# EAGLE design B134B (EAGLE 6.6.0)
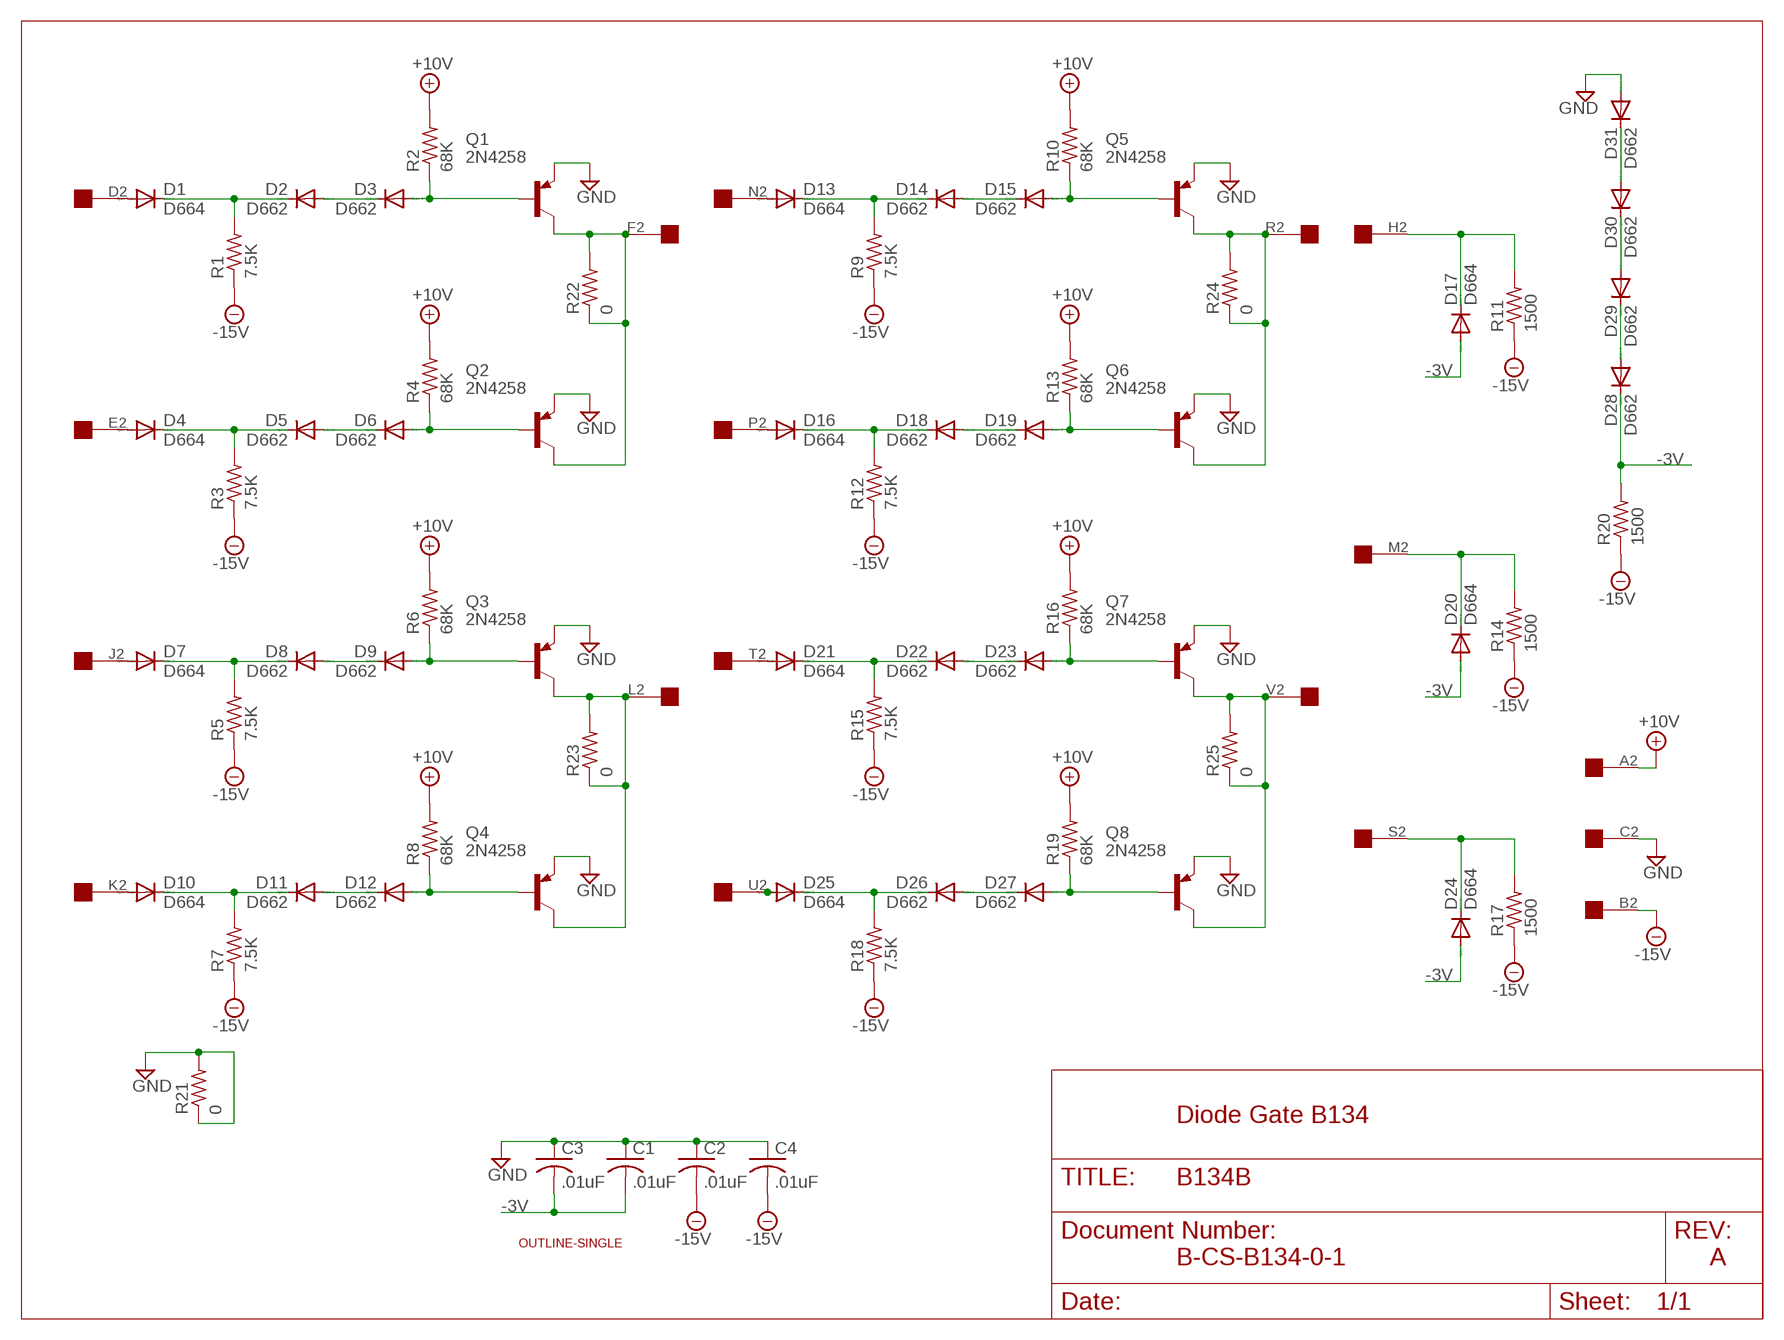
[diagram p0: schematic, sheet 1]

## Parts
C1  .01uF  C-US  [C063-025X075]
C2  .01uF  C-US  [C063-025X075]
C3  .01uF  C-US  [C063-025X075]
C4  .01uF  C-US  [C063-025X075]
D1  D664  DIODE-DO35-10  [DO35-10]
D2  D662  DIODE-DO35-10  [DO35-10]
D3  D662  DIODE-DO35-10  [DO35-10]
D4  D664  DIODE-DO35-10  [DO35-10]
D5  D662  DIODE-DO35-10  [DO35-10]
D6  D662  DIODE-DO35-10  [DO35-10]
D7  D664  DIODE-DO35-10  [DO35-10]
D8  D662  DIODE-DO35-10  [DO35-10]
D9  D662  DIODE-DO35-10  [DO35-10]
D10  D664  DIODE-DO35-10  [DO35-10]
D11  D662  DIODE-DO35-10  [DO35-10]
D12  D662  DIODE-DO35-10  [DO35-10]
D13  D664  DIODE-DO35-10  [DO35-10]
D14  D662  DIODE-DO35-10  [DO35-10]
D15  D662  DIODE-DO35-10  [DO35-10]
D16  D664  DIODE-DO35-10  [DO35-10]
D17  D664  DIODE-DO35-10  [DO35-10]
D18  D662  DIODE-DO35-10  [DO35-10]
D19  D662  DIODE-DO35-10  [DO35-10]
D20  D664  DIODE-DO35-10  [DO35-10]
D21  D664  DIODE-DO35-10  [DO35-10]
D22  D662  DIODE-DO35-10  [DO35-10]
D23  D662  DIODE-DO35-10  [DO35-10]
D24  D664  DIODE-DO35-10  [DO35-10]
D25  D664  DIODE-DO35-10  [DO35-10]
D26  D662  DIODE-DO35-10  [DO35-10]
D27  D662  DIODE-DO35-10  [DO35-10]
D28  D662  DIODE-DO35-10  [DO35-10]
D29  D662  DIODE-DO35-10  [DO35-10]
D30  D662  DIODE-DO35-10  [DO35-10]
D31  D662  DIODE-DO35-10  [DO35-10]
Q1  2N4258  -PNP-TO5  [TO5]
Q2  2N4258  -PNP-TO5  [TO5]
Q3  2N4258  -PNP-TO5  [TO5]
Q4  2N4258  -PNP-TO5  [TO5]
Q5  2N4258  -PNP-TO5  [TO5]
Q6  2N4258  -PNP-TO5  [TO5]
Q7  2N4258  -PNP-TO5  [TO5]
Q8  2N4258  -PNP-TO5  [TO5]
R1  7.5K  R-US_0207/10  [0207/10]
R2  68K  R-US_0207/10  [0207/10]
R3  7.5K  R-US_0207/10  [0207/10]
R4  68K  R-US_0207/10  [0207/10]
R5  7.5K  R-US_0207/10  [0207/10]
R6  68K  R-US_0207/10  [0207/10]
R7  7.5K  R-US_0207/10  [0207/10]
R8  68K  R-US_0207/10  [0207/10]
R9  7.5K  R-US_0207/10  [0207/10]
R10  68K  R-US_0207/10  [0207/10]
R11  1500  R-US_0207/10  [0207/10]
R12  7.5K  R-US_0207/10  [0207/10]
R13  68K  R-US_0207/10  [0207/10]
R14  1500  R-US_0207/10  [0207/10]
R15  7.5K  R-US_0207/10  [0207/10]
R16  68K  R-US_0207/10  [0207/10]
R17  1500  R-US_0207/10  [0207/10]
R18  7.5K  R-US_0207/10  [0207/10]
R19  68K  R-US_0207/10  [0207/10]
R20  1500  R-US_0207/10  [0207/10]
R21  0  R-US_0207/10  [0207/10]
R22  0  R-US_0207/10  [0207/10]
R23  0  R-US_0207/10  [0207/10]
R24  0  R-US_0207/10  [0207/10]
R25  0  R-US_0207/10  [0207/10]
U$1  OUTLINE-SINGLE  [SINGLE]
U$2  EDGE-1  [EDGE-CON1]

## Nets
+10V: R2.2 R4.2 R6.2 R8.2 R10.2 R13.2 R16.2 R19.2 U$2.A2
-3V [Supply]: C1.2 C3.2 D17.A D20.A D24.A D28.C R20.2
-15V: C2.2 C4.2 R1.1 R3.1 R5.1 R7.1 R9.1 R11.1 R12.1 R14.1 R15.1 R17.1 R18.1 R20.1 U$2.B2
GND [Supply]: C1.1 C2.1 C3.1 C4.1 D31.A Q1.1(E) Q2.1(E) Q3.1(E) Q4.1(E) Q5.1(E) Q6.1(E) Q7.1(E) Q8.1(E) R21.1 R21.2 U$2.C2
N$1: D4.C D5.C R3.2
N$2: D10.C D11.C R7.2
N$3: D3.A Q1.2(B) R2.1
N$4: D13.C D14.C R9.2
N$5: D1.C D2.C R1.2
N$6: D4.A U$2.E2
N$7: D13.A U$2.N2
N$8: D11.A D12.C
N$9: D5.A D6.C
N$10: D1.A U$2.D2
N$11: D14.A D15.C
N$12: D6.A Q2.2(B) R4.1
N$13: Q1.3(C) Q2.3(C) R22.1 R22.2 U$2.F2
N$14: D7.C D8.C R5.2
N$15: D2.A D3.C
N$16: D7.A U$2.J2
N$17: D17.C R11.2 U$2.H2
N$18: D15.A Q5.2(B) R10.1
N$19: D10.A U$2.K2
N$20: D20.C R14.2 U$2.M2
N$21: D8.A D9.C
N$22: D9.A Q3.2(B) R6.1
N$23: D16.C D18.C R12.2
N$24: D12.A Q4.2(B) R8.1
N$25: D24.C R17.2 U$2.S2
N$26: D30.A D31.C
N$27: D29.A D30.C
N$28: D19.A Q6.2(B) R13.1
N$29: D28.A D29.C
N$30: D18.A D19.C
N$31: D23.A Q7.2(B) R16.1
N$33: D21.C D22.C R15.2
N$34: D22.A D23.C
N$35: D27.A Q8.2(B) R19.1
N$36: D16.A U$2.P2
N$37: D21.A U$2.T2
N$38: D25.C D26.C R18.2
N$39: D26.A D27.C
N$41: Q7.3(C) Q8.3(C) R25.1 R25.2 U$2.V2
N$42: D25.A U$2.U2
N$44: Q3.3(C) Q4.3(C) R23.1 R23.2 U$2.L2
N$45: Q5.3(C) Q6.3(C) R24.1 R24.2 U$2.R2

## Notes on the sheet
- Diode Gate B134
- B-CS-B134-0-1 | A

## Library data of the parts
C1-C4 = dec-con:C-US: Capacitors with funky DEC lead spacing.
D1-D31 = diode:DIODE-: DIODE
Q1-Q8 = transistor:*-PNP-: PNP Transistror
R1-R25 = rcl:R-US_: RESISTOR, American symbol
U$1 = dec-con:OUTLINE-*: Board outlines for DEC boards.
U$2 = dec-con:EDGE-1: Single-Sided DEC Edge Connector -- (side 2)

## Net classes
0 default: width 0.813 mm
1 Supply: width 0.813 mm

## Board
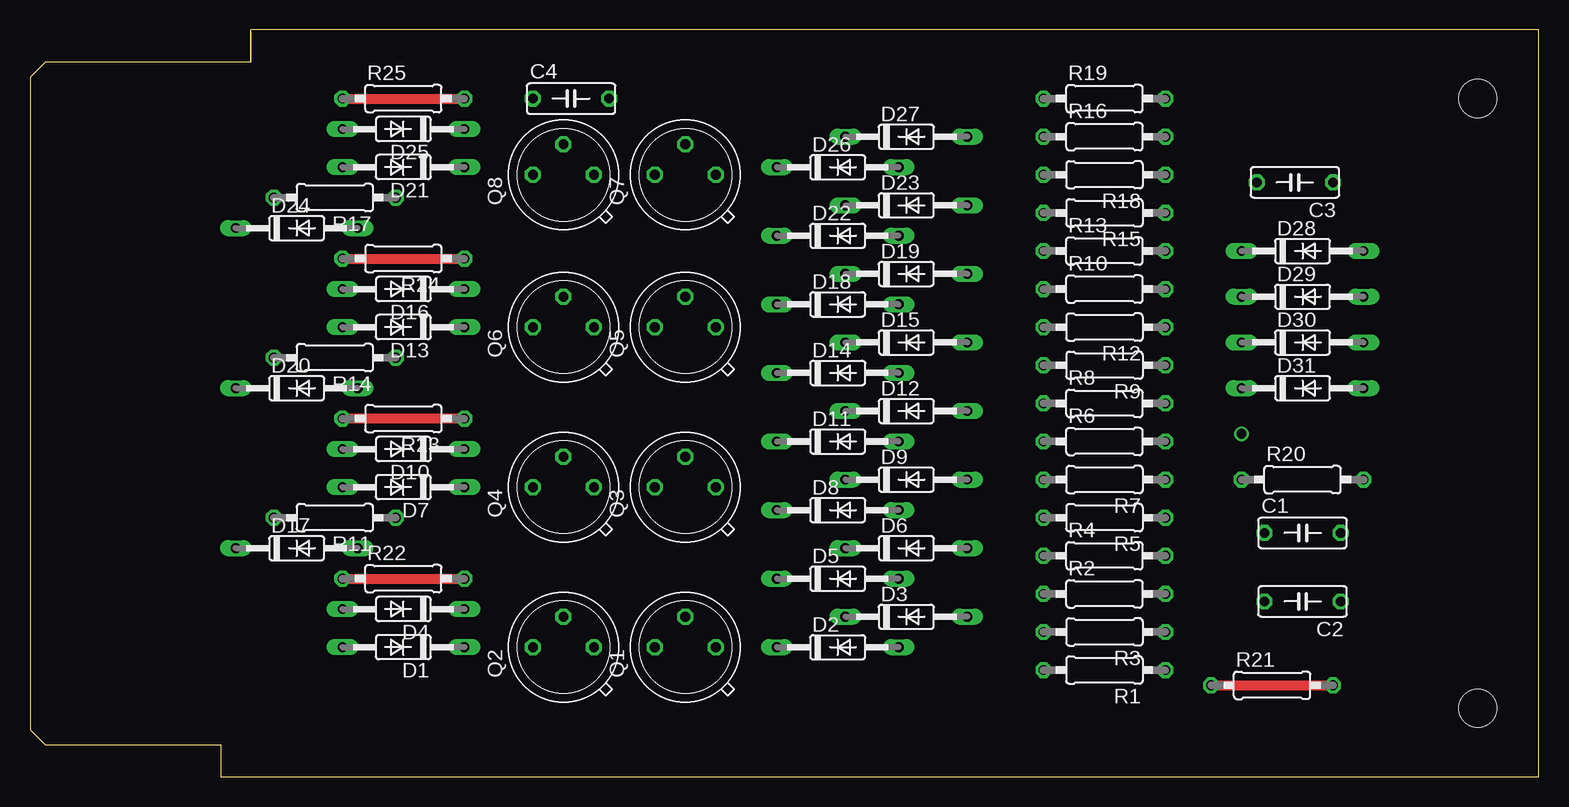
[diagram p1: board, top side]
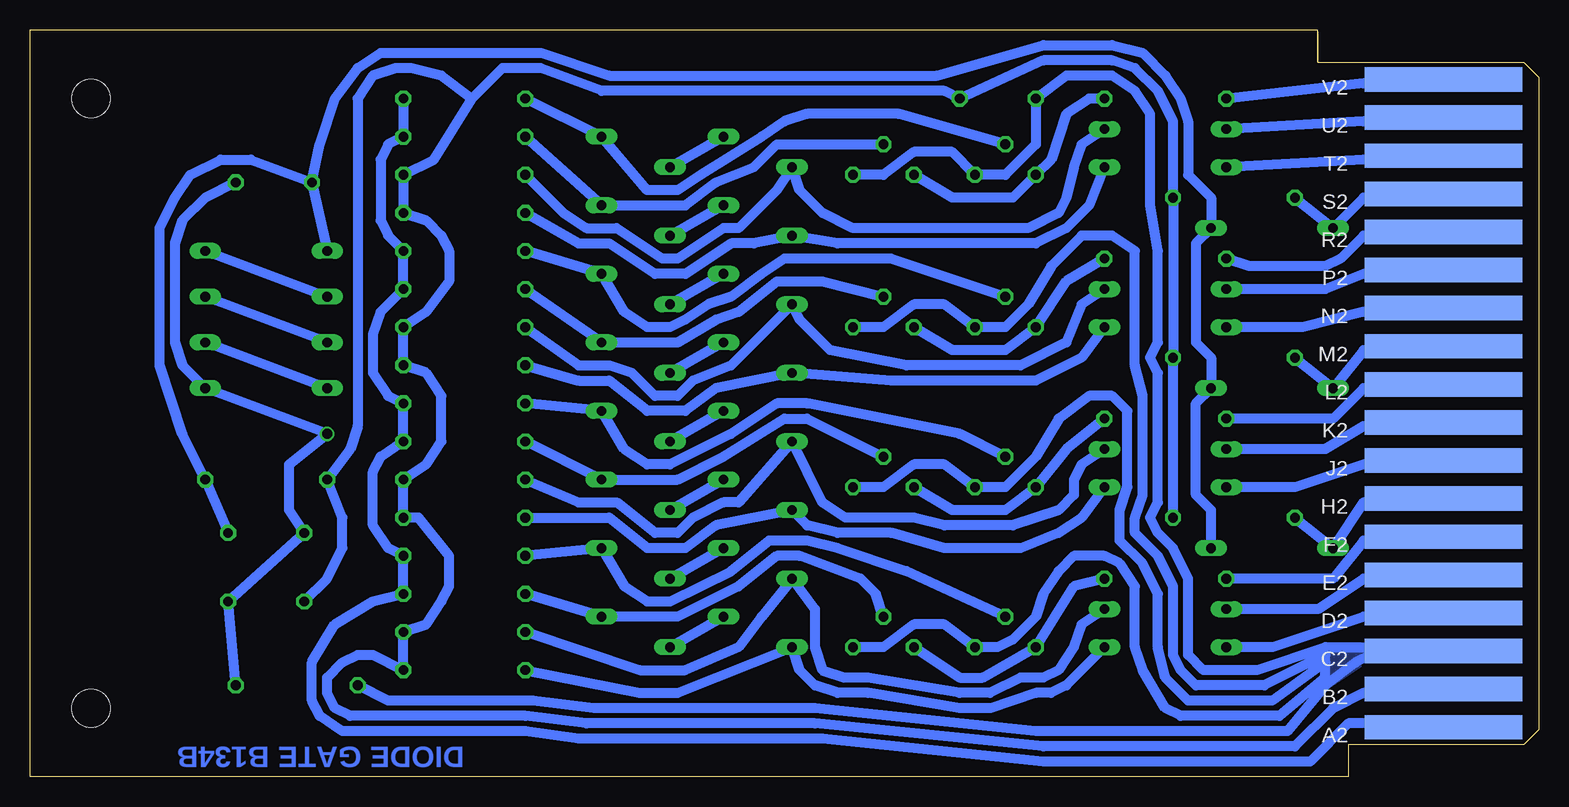
[diagram p2: board, bottom side, seen from below]

Size 125.73 x 62.23 mm. Coordinates in mm from the lower left corner, seen from the top.
Copper layers (1+16): Top 0.035mm / dielectric 1.5mm / Bottom 0.035mm
Design rules "16mils": minimum track width 16mil, minimum drill 32mil, track to track 15mil, track to pad 10mil, pad to pad 10mil, via to via 10mil, smd to smd 10mil, copper to edge 13mil, drill to drill 10mil, minimum pad ring 10mil, minimum via ring 8mil, stop-mask expansion 0mil, vias tented up to drill 0mil, thermal gap 10mil

### Footprints (pad centres in the part's own frame; a part is rotated, then mirrored left to right if it is on the bottom)
C063-025X075 = drill 0.813 octagon: 1 -2.54,0; 2 3.81,0
DO35-10 = drill 0.813 long: A 5.08,0; C -5.08,0
TO5 = drill 0.813 octagon: 1 0,-2.54; 2 2.54,0; 3 0,2.54
0207/10 = drill 0.813 octagon: 1 -5.08,0; 2 5.08,0
SINGLE = hole 3.175: 120.65,56.515; 120.65,5.715
EDGE-CON1 = smd 13.106 x 2.032 bottom: A2 7.938,4.128; B2 7.938,7.303; C2 7.938,10.477; D2 7.938,13.652; E2 7.938,16.828; F2 7.938,20.003; H2 7.938,23.177; J2 7.938,26.352; K2 7.938,29.527; L2 7.938,32.703; M2 7.938,35.877; N2 7.938,39.053; P2 7.938,42.227; R2 7.938,45.403; S2 7.938,48.578; T2 7.938,51.752; U2 7.938,54.928; V2 7.938,58.102

### Placement (x,y rotation side)
C1  105.41,20.32 0 top
C2  106.68,14.61 180 top
C3  106.05,49.53 180 top
C4  44.45,56.52 0 top
D1  31.12,10.79 180 top
D2  67.31,10.79 0 top
D3  73.03,13.34 0 top
D4  31.12,13.97 180 top
D5  67.31,16.51 0 top
D6  73.03,19.05 0 top
D7  31.12,24.13 180 top
D8  67.31,22.23 0 top
D9  73.03,24.77 0 top
D10  31.12,27.3 180 top
D11  67.31,27.94 0 top
D12  73.03,30.48 0 top
D13  31.12,37.47 180 top
D14  67.31,33.66 0 top
D15  73.03,36.2 0 top
D16  31.12,40.64 180 top
D17  22.23,19.05 0 top
D18  67.31,39.37 0 top
D19  73.03,41.91 0 top
D20  22.23,32.38 0 top
D21  31.12,50.8 180 top
D22  67.31,45.09 0 top
D23  73.03,47.62 0 top
D24  22.23,45.72 0 top
D25  31.12,53.98 180 top
D26  67.31,50.8 0 top
D27  73.03,53.34 0 top
D28  106.05,43.81 0 top
D29  106.05,40.01 0 top
D30  106.05,36.2 0 top
D31  106.05,32.38 0 top
Q1  54.61,10.79 90 top
Q2  44.45,10.79 90 top
Q3  54.61,24.13 90 top
Q4  44.45,24.13 90 top
Q5  54.61,37.47 90 top
Q6  44.45,37.47 90 top
Q7  54.61,50.16 90 top
Q8  44.45,50.16 90 top
R1  89.54,8.89 180 top
R2  89.54,15.24 0 top
R3  89.54,12.06 180 top
R4  89.54,18.41 0 top
R5  89.54,21.59 180 top
R6  89.54,27.94 0 top
R7  89.54,24.77 180 top
R8  89.54,31.11 0 top
R9  89.54,34.29 180 top
R10  89.54,40.64 0 top
R11  25.4,21.59 180 top
R12  89.54,37.47 180 top
R13  89.54,43.81 0 top
R14  25.4,34.92 180 top
R15  89.54,46.99 180 top
R16  89.54,53.34 0 top
R17  25.4,48.26 180 top
R18  89.54,50.16 180 top
R19  89.54,56.52 0 top
R20  106.05,24.77 0 top
R21  103.51,7.62 0 top
R22  31.12,16.51 0 top
R23  31.12,29.84 180 top
R24  31.12,43.18 180 top
R25  31.12,56.52 0 top
U$1  0,0 0 top
U$2  0,0 0 top

### Tracks (layer width: path | path; a pad name or v marks a point on that pad's centre or on a via)
+10V
  Bottom 0.813: R19.2 R16.2 95.89,52.7 96.52,51.44 96.52,46.35 95.89,45.09 R13.2 R10.2 96.52,38.73 97.16,36.83 97.16,33.66 95.89,31.75 R8.2 R6.2 96.52,26.67 97.16,25.4 97.16,20.95 95.89,19.05 R4.2 R2.2 97.16,14.61 100.33,12.7 102.24,9.53 102.24,6.35 101.6,5.08 99.7,3.81 84.46,3.81 80.01,3.17 59.69,3.17 41.28,1.27 19.05,1.27 15.88,4.45 8.89,4.45 U$2.A2
-3V
  Bottom 0.813: C1.2 R20.2 113.03,28.57 114.94,34.29 114.94,45.72 113.67,48.26 112.4,50.16 109.86,51.44 107.32,51.44 C3.2 | C3.2 D28.C | C3.2 101.6,52.7 100.33,56.52 98.43,59.05 96.52,60.33 83.19,60.33 77.47,58.42 50.17,58.42 41.28,60.96 35.56,60.96 33.02,60.33 31.12,58.42 29.85,56.52 29.21,54.61 29.21,50.16 27.31,48.26 D24.A 28.58,44.45 28.58,36.2 27.31,34.92 D20.A 28.58,31.11 28.58,23.5 27.31,22.23 D17.A
-15V
  Bottom 0.813: 88.9,56.52 92.08,51.44 R18.1 R15.1 92.71,46.35 91.44,45.09 90.81,43.81 90.81,41.27 92.71,38.73 R12.1 R9.1 92.71,33.66 91.44,31.75 91.44,27.94 92.71,26.04 R7.1 R5.1 93.35,21.59 90.81,18.41 90.81,15.88 91.44,14.61 92.71,12.7 R3.1 R1.1 97.16,10.16 98.43,10.16 99.7,9.53 100.97,8.26 100.97,6.99 100.33,5.71 99.06,5.08 84.46,5.08 79.38,4.45 60.33,4.45 41.28,2.54 20.32,2.54 17.15,5.71 14.61,6.99 8.26,6.99 U$2.B2 | 88.9,56.52 91.44,58.42 93.98,59.05 95.25,59.05 97.16,58.42 98.43,56.52 98.43,29.21 99.06,27.3 R20.1 99.7,21.59 99.7,19.05 100.97,16.51 C2.2 | 88.9,56.52 86.36,59.05 83.19,59.05 78.11,57.15 49.53,57.15 C4.2 41.28,59.69 35.56,59.69 33.66,59.05 31.75,57.15 30.48,54.61 R17.1 R14.1 R11.1
GND  (via drill 0.81)
  Top 0.813: R21.1 R21.2
  Bottom 0.813: Q1.1 54.61,10.79 52.07,12.7 49.53,12.7 Q2.1 45.09,10.79 43.82,11.43 41.91,13.34 41.28,15.24 40.01,17.14 38.74,18.41 36.2,18.41 34.93,17.78 33.66,15.88 33.66,10.79 33.02,8.89 31.12,5.71 29.85,5.08 21.59,5.08 17.78,8.26 | Q3.1 54.61,24.13 52.07,26.04 49.53,26.04 Q4.1 44.45,24.13 41.91,26.67 40.01,29.84 37.47,31.75 35.56,31.75 34.29,30.48 34.29,24.13 34.93,22.23 34.93,19.68 33.02,17.78 31.75,15.24 31.75,10.79 31.12,8.26 29.21,6.35 22.23,6.35 17.78,9.53 | Q5.1 54.61,37.47 52.07,39.37 49.53,39.37 Q6.1 44.45,37.47 42.55,39.37 40.64,42.55 38.1,45.09 35.56,45.09 33.66,43.81 33.66,34.29 33.02,31.75 33.02,23.5 33.66,21.59 33.66,20.32 31.75,18.41 30.48,15.88 30.48,10.16 29.85,8.89 28.58,7.62 22.86,7.62 17.78,10.16 | Q7.1 54.61,50.16 52.07,52.07 48.9,52.07 Q8.1 44.45,50.16 41.91,52.7 C4.1 39.37,58.42 35.56,58.42 33.66,57.15 32.39,55.24 32.39,47.62 31.75,43.81 31.75,36.2 32.39,34.92 31.75,33.66 31.75,22.86 32.39,21.59 31.75,20.32 30.48,19.05 29.21,16.51 29.21,10.16 27.94,8.89 23.5,8.89 17.78,10.79 | R21.2 C2.1 C1.1 104.14,22.23 104.14,26.04 v100.97,28.57 D31.A 113.03,34.29 113.67,36.2 113.67,44.45 113.03,46.35 111.13,48.26 C3.1 | U$2.C2 9.53,10.16 13.97,10.16 | 13.97,10.16 15.24,9.53 17.78,7.62 | 17.78,7.62 17.78,8.26 | 17.78,8.26 17.78,9.53 | 17.78,9.53 17.78,10.16 | 17.78,10.16 17.78,10.79 | 17.78,10.79 13.97,10.79 13.97,10.16 | 17.78,7.62 20.96,3.81 41.91,3.81 60.33,5.71 78.74,5.71 83.82,6.35 95.89,6.35 R21.1
  pour Bottom: 13.97,10.79 17.78,10.79 17.78,7.62 13.97,10.16
N$1
  Bottom 0.813: D4.C 38.1,12.7 38.74,10.79 40.01,8.89 41.28,8.26 43.18,8.26 45.72,6.99 48.26,6.99 55.88,8.26 57.79,8.26 59.69,8.89 60.33,10.79 60.33,13.97 D5.C 64.77,13.34 66.68,10.79 71.12,8.89 74.93,8.89 R3.2
N$2
  Bottom 0.813: R7.2 80.01,22.86 76.84,22.86 73.66,20.32 71.76,20.32 70.49,21.59 67.95,22.86 66.68,22.86 D11.C 59.69,22.86 57.79,21.59 52.07,21.59 49.53,20.95 43.82,20.95 40.01,22.23 38.74,23.5 38.74,24.77 38.1,26.04 D10.C
N$3
  Bottom 0.813: R2.1 D3.A 71.76,13.34 66.68,15.88 63.5,18.41 61.6,18.41 56.52,16.51 55.25,15.24 Q1.2
N$4
  Bottom 0.813: R9.2 80.01,33.02 77.47,33.02 74.3,30.48 71.12,30.48 68.58,32.38 D14.C 53.98,33.02 41.91,33.02 38.1,34.92 D13.C
N$5
  Bottom 0.813: D1.C 39.37,7.62 40.64,6.99 41.91,6.99 45.72,5.71 48.26,5.71 55.88,6.99 58.42,6.99 60.33,7.62 61.6,8.89 D2.C 71.76,6.99 74.93,6.99 R1.2
N$6
  Bottom 0.813: U$2.E2 8.89,16.51 14.61,16.51 18.42,13.97 D4.A
N$7
  Bottom 0.813: U$2.N2 8.89,38.73 14.61,38.73 19.69,37.47 D13.A
N$8
  Bottom 0.813: D12.C D11.A
N$9
  Bottom 0.813: D6.C D5.A
N$10
  Bottom 0.813: U$2.D2 8.89,13.34 14.61,13.34 22.23,10.79 D1.A
N$11
  Bottom 0.813: D15.C D14.A
N$12
  Bottom 0.813: R4.1 D6.A 76.2,15.88 74.3,14.61 72.39,14.61 67.31,17.14 64.14,19.68 60.96,19.68 58.42,19.05 52.71,17.14 Q2.2
N$13
  Top 0.813: R22.1 R22.2
  Bottom 0.813: R22.2 38.74,15.88 Q2.3 46.36,8.26 48.26,8.26 Q1.3 | U$2.F2 9.53,19.68 14.61,19.68 17.15,16.51 R22.1
N$14
  Bottom 0.813: R5.2 77.47,21.59 74.3,19.05 71.12,19.05 68.58,20.95 D8.C 60.96,20.95 58.42,20.32 53.98,20.32 49.53,19.05 43.18,19.05 40.01,20.32 38.1,21.59 D7.C
N$15
  Bottom 0.813: D3.C D2.A
N$16
  Bottom 0.813: U$2.J2 8.89,26.04 14.61,26.04 20.32,24.13 D7.A
N$17
  Bottom 0.813: U$2.H2 8.26,22.86 14.61,22.86 D17.C R11.2
N$18
  Bottom 0.813: R10.1 D15.A 71.76,36.2 68.58,38.1 66.68,38.73 63.5,41.27 59.69,41.27 Q5.2
N$19
  Bottom 0.813: U$2.K2 8.89,29.21 14.61,29.21 17.78,27.3 D10.A
N$20
  Bottom 0.813: U$2.M2 8.89,35.56 14.61,35.56 D20.C R14.2
N$21
  Bottom 0.813: D9.C D8.A
N$22
  Bottom 0.813: R6.1 D9.A 71.76,24.77 67.95,26.67 62.87,29.84 60.96,29.84 Q3.2
N$23
  Bottom 0.813: R12.2 80.01,34.29 77.47,34.29 75.57,33.66 73.66,31.75 71.76,31.75 70.49,33.02 67.31,34.29 D18.C 61.6,38.1 59.06,35.56 52.71,34.29 43.18,34.29 39.37,36.2 38.1,39.37 D16.C
N$24
  Bottom 0.813: R8.1 D12.A 76.2,27.3 74.3,26.04 72.39,26.04 67.31,28.57 63.5,31.11 60.96,31.11 48.26,28.57 Q4.2
N$25
  Bottom 0.813: U$2.S2 8.26,48.26 14.61,48.26 D24.C R17.2
N$26
  Bottom 0.813: D31.C D30.A
N$27
  Bottom 0.813: D30.C D29.A
N$28
  Bottom 0.813: R13.1 D19.A 76.2,38.73 74.3,37.47 72.39,37.47 71.12,38.1 69.22,39.37 67.31,40.01 64.77,41.91 62.87,43.18 53.98,43.18 Q6.2
N$29
  Bottom 0.813: D28.A D29.C
N$30
  Bottom 0.813: D19.C D18.A
N$31
  Bottom 0.813: R16.1 D23.A 71.12,47.62 68.58,49.53 65.41,50.8 63.5,52.7 Q7.2
N$33
  Bottom 0.813: R15.2 80.01,44.45 77.47,44.45 73.66,41.91 71.12,41.91 67.31,44.45 65.41,44.45 D22.C 58.42,44.45 41.91,44.45 39.37,45.72 37.47,47.62 D21.C
N$34
  Bottom 0.813: D23.C D22.A
N$35
  Bottom 0.813: R19.1 D27.A 74.3,48.9 71.76,48.9 69.85,50.16 64.77,53.34 62.87,54.61 60.96,55.24 53.34,55.24 Q8.2
N$36
  Bottom 0.813: U$2.P2 8.89,41.91 14.61,41.91 17.78,40.64 D16.A
N$37
  Bottom 0.813: U$2.T2 8.89,51.44 14.61,51.44 D21.A
N$38
  Bottom 0.813: R18.2 81.28,46.99 79.38,45.72 76.84,45.72 73.03,43.18 71.76,43.18 67.95,45.72 66.68,45.72 63.5,48.9 D26.C 61.6,48.9 59.69,46.99 57.15,45.72 42.55,45.72 40.01,46.99 39.37,48.26 38.74,50.8 38.1,52.7 D25.C
N$39
  Bottom 0.813: D27.C D26.A
N$41
  Top 0.813: R25.1 R25.2
  Bottom 0.813: Q7.3 48.9,48.26 43.82,48.26 Q8.3 40.64,51.44 39.37,55.24 37.47,56.52 R25.2 | U$2.V2 9.53,57.78 14.61,57.78 R25.1
N$42
  Bottom 0.813: U$2.U2 8.89,54.61 14.61,54.61 D25.A
N$44
  Top 0.813: R23.1 R23.2
  Bottom 0.813: Q3.3 48.9,22.23 44.45,22.23 Q4.3 39.37,27.3 R23.1 | U$2.L2 8.89,32.38 14.61,32.38 17.15,29.84 R23.2
N$45
  Top 0.813: R24.2 R24.1
  Bottom 0.813: Q5.3 48.9,35.56 44.45,35.56 Q6.3 39.37,41.27 R24.1 | U$2.R2 8.89,45.09 14.61,45.09 16.51,43.18 17.78,42.55 24.13,42.55 R24.2

### Text on the board
Bottom: DIODE GATE B134B